# Altium schematic sheet [11] - COMMUNICATION.SchDoc: X
size A4; Date: DD-MM-YYYY; CheckedBy: X; DrawnBy: Y; Revision: 0.0.0; SheetNumber: X; SheetTotal: Y; Projectnumber: OWN-000; Size: A4; Projectname: X
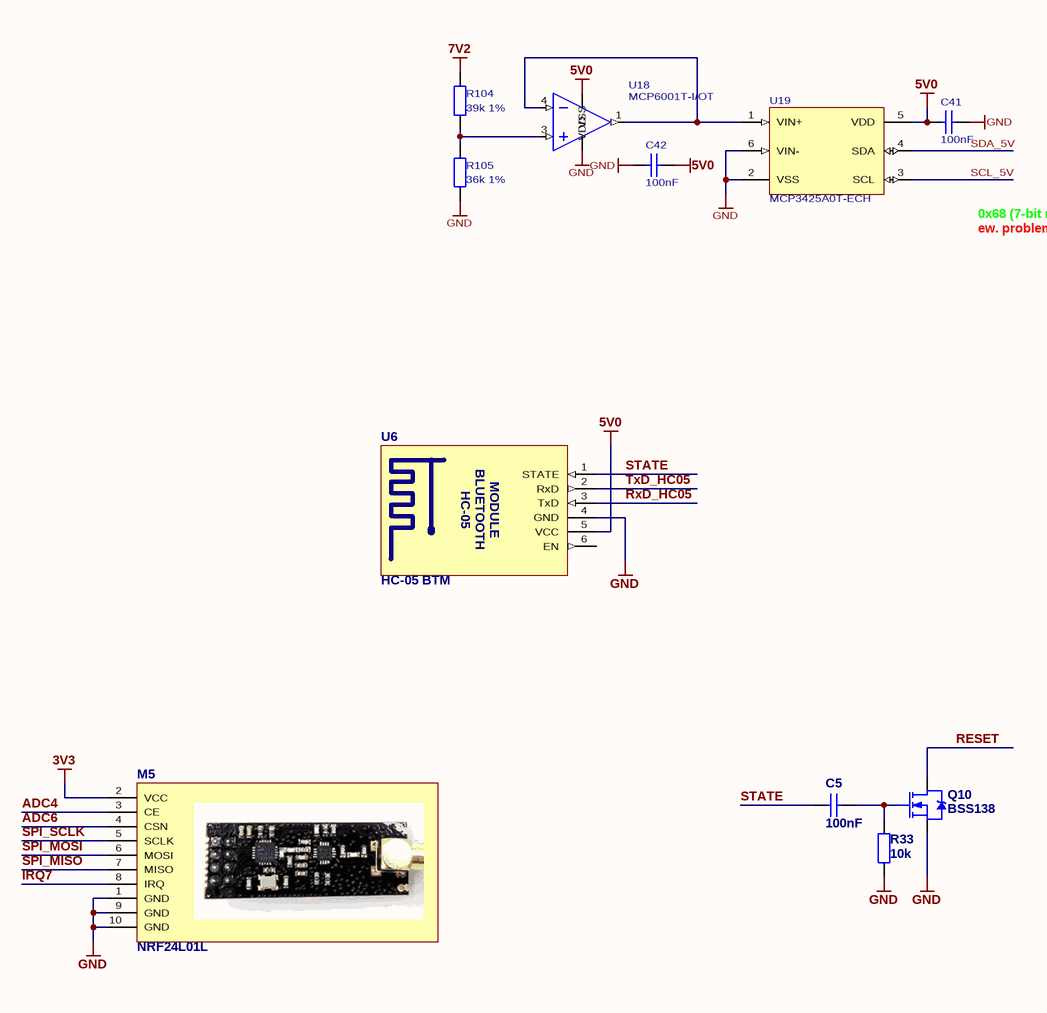
[diagram p0: [11] - COMMUNICATION.SchDoc]

## Parts
C5  100nF  [C0805]
C41  100nF  [C0805]
C42  100nF  [C0805]
M5  NRF24L01L  [NRF24L01L]
Q10  BSS138  [SOT-23]
R33  10k  [R0805]
R104  39k 1%  [R0805]
R105  36k 1%  [R0805]
U6  HC-05 BTM  [HC-05_H_2]
U18  MCP6001T-I/OT  [SOT-23-5]
U19  MCP3425A0T-ECH  [SOT-23-6]

## Nets
3V3: M5.2(VCC)
5V0: C41.1 C42.1 U6.5(VCC) U18.5(VDD) U19.5(VDD)
7V2: R104.1
GND: C41.2 C42.2 M5.1(GND) M5.9(GND) M5.10(GND) Q10.2(S) R33.2 R105.2 U6.4(GND) U18.2(VSS) U19.2(VSS) U19.6(VIN-)
ADC4: M5.3(CE)
ADC6: M5.4(CSN)
IRQ7: M5.8(IRQ)
RESET: Q10.3(D)
RxD_HC05: U6.3(TxD)
SCL_5V: U19.3(SCL)
SDA_5V: U19.4(SDA)
SPI_MISO: M5.7(MISO)
SPI_MOSI: M5.6(MOSI)
SPI_SCLK: M5.5(SCLK)
STATE: C5.1 U6.1(STATE)
TxD_HC05: U6.2(RxD)
NetC5_2: C5.2 Q10.1(G) R33.1
NetR104_2: R104.2 R105.1 U18.3(IN+)
NetU18_1: U18.1(OUT) U18.4(IN-) U19.1(VIN+)

Not connected (* = marked no-connect by the designer): U6 6(EN)

## Notes on the sheet
- (near U19) 0x68 (7-bit mode) / 0xD0 (8-bit mode)
- (near U19) ew. problem z komunikacją - VIH!!!
- REV:
- A  P  P  R  O  V  E  D
- /
- Lodz University of Technology
- ul. Wolczanska 211/215
- 90-924 LODZ, POLAND
- Institute of Electronics
- Project name:
- Title:
- Author:
- Verified by:
- (in symbol HC-05_BTM) HC-05; BLUETOOTH; MODULE

## Library data of the parts
C5 C41 C42 = Cap: Capacitor; ComponentLink1Description: datasheet; ComponentLink2Description: supplier; Value: 100nF
M5 = NRF24L01L: Long Range Wireless Module R2 (1.1KM, PA+SMA)
Q10 = BSS138: N-Channel Enhancement Mode Vertical DMOS FET; Published: 17-Dec-2003; DatasheetVersion: Mar-96; PackageVersion: 1996; PackageReference: SOT23; Publisher: Altium Limited; PackageDescription: SOT-23; 3 Leads; Body 3.1 x 2.5 mm, inc. leads (LxW max), Alternate Lead Configuration; ComponentLink1Description: Manufacturer Link; ComponentLink1URL: http://www.zetex.com/; ComponentLink2Description: Datasheet; ComponentLink2URL: www.zetex.com/3.0/pdf/BSS138.pdf
R33 R104 R105 = Res: Resistor; Published: 19-Feb-2006; ComponentLink1Description: datasheet; ComponentLink2Description: supplier
  R33: Value: 10k
  R104: Value: 39k 1%
  R105: Value: 36k 1%
U6 = HC-05_BTM: HC-05 Bluetooth Module
U18 = MCP6001T-I/OT: Rail-to-rail, 1MHz, 100uA Op Amp; Supplier 1: Farnell; Supplier 2: TME; Supplier Part Number 1: 1825040; Supplier Part Number 2: MCP6401T-E/OT
U19 = MCP3425A0T-ECH: 16-Bit Analog-to-Digital Converter with I2C Interface and On-Board Reference; Supplier 1: Farnell; Supplier 2: Farnell; Supplier 3: Farnell; Supplier 4: TME; Supplier Part Number 1: 1578433; Supplier Part Number 2: 2371380; Supplier Part Number 3: 1578433RL; Supplier Part Number 4: MCP3425A0T-ECH